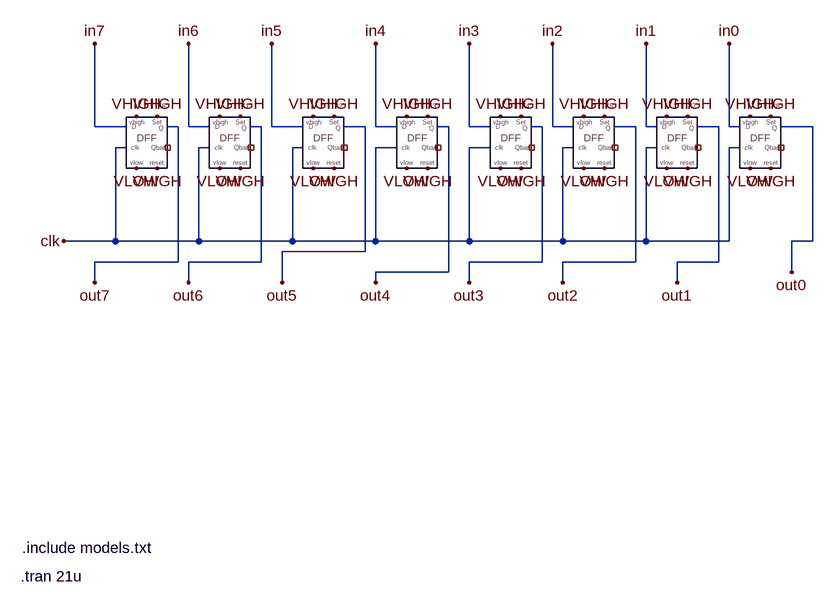
[diagram p0: schematic outputdoor.asc]
outputdoor.asc, the LTspice schematic file:
Version 4
SHEET 1 908 820
WIRE -208 112 -208 -16
WIRE -160 112 -208 112
WIRE -80 112 -96 112
WIRE -64 112 -64 -16
WIRE -32 112 -64 112
WIRE 48 112 32 112
WIRE 64 112 64 -16
WIRE 112 112 64 112
WIRE 208 112 176 112
WIRE 224 112 224 -16
WIRE 256 112 224 112
WIRE 336 112 320 112
WIRE 368 112 368 -16
WIRE 400 112 368 112
WIRE 480 112 464 112
WIRE 496 112 496 -16
WIRE 528 112 496 112
WIRE 624 112 592 112
WIRE 640 112 640 -16
WIRE 656 112 640 112
WIRE 752 112 720 112
WIRE 768 112 768 -16
WIRE 784 112 768 112
WIRE 896 112 848 112
WIRE -160 144 -176 144
WIRE -32 144 -48 144
WIRE 112 144 96 144
WIRE 256 144 224 144
WIRE 400 144 368 144
WIRE 528 144 512 144
WIRE 656 144 640 144
WIRE 784 144 768 144
WIRE -176 288 -176 144
WIRE -176 288 -256 288
WIRE -48 288 -48 144
WIRE -48 288 -176 288
WIRE 96 288 96 144
WIRE 96 288 -48 288
WIRE 224 288 224 144
WIRE 224 288 96 288
WIRE 368 288 368 144
WIRE 368 288 224 288
WIRE 512 288 512 144
WIRE 512 288 368 288
WIRE 640 288 640 144
WIRE 640 288 512 288
WIRE 768 288 768 144
WIRE 768 288 640 288
WIRE 896 288 896 112
WIRE 896 288 864 288
WIRE 208 304 208 112
WIRE 208 304 80 304
WIRE -80 320 -80 112
WIRE -80 320 -208 320
WIRE 48 320 48 112
WIRE 48 320 -64 320
WIRE 480 320 480 112
WIRE 480 320 368 320
WIRE 624 320 624 112
WIRE 624 320 512 320
WIRE 752 320 752 112
WIRE 752 320 688 320
WIRE 336 336 336 112
WIRE 336 336 224 336
WIRE 864 336 864 288
WIRE -208 352 -208 320
WIRE -64 352 -64 320
WIRE 80 352 80 304
WIRE 224 352 224 336
WIRE 368 352 368 320
WIRE 512 352 512 320
WIRE 688 352 688 320
FLAG -144 96 VHIGH
FLAG -112 96 VHIGH
FLAG -112 176 VHIGH
FLAG -16 96 VHIGH
FLAG 16 96 VHIGH
FLAG 16 176 VHIGH
FLAG 128 96 VHIGH
FLAG 160 96 VHIGH
FLAG 160 176 VHIGH
FLAG 304 176 VHIGH
FLAG 304 96 VHIGH
FLAG 272 96 VHIGH
FLAG 416 96 VHIGH
FLAG 448 96 VHIGH
FLAG 448 176 VHIGH
FLAG 576 96 VHIGH
FLAG 544 96 VHIGH
FLAG 576 176 VHIGH
FLAG 704 176 VHIGH
FLAG 704 96 VHIGH
FLAG 672 96 VHIGH
FLAG 672 176 VLOW
FLAG 544 176 VLOW
FLAG 416 176 VLOW
FLAG 272 176 VLOW
FLAG 128 176 VLOW
FLAG -16 176 VLOW
FLAG -144 176 VLOW
FLAG -256 288 clk
FLAG 640 -16 in1
FLAG 496 -16 in2
FLAG 368 -16 in3
FLAG 224 -16 in4
FLAG 64 -16 in5
FLAG -64 -16 in6
FLAG -208 -16 in7
FLAG 832 176 VHIGH
FLAG 832 96 VHIGH
FLAG 800 96 VHIGH
FLAG 800 176 VLOW
FLAG 768 -16 in0
FLAG 864 336 out0
FLAG 688 352 out1
FLAG 512 352 out2
FLAG 368 352 out3
FLAG 224 352 out4
FLAG 80 352 out5
FLAG -64 352 out6
FLAG -208 352 out7
SYMBOL DFF 48 128 R0
SYMATTR InstName X1
SYMBOL DFF 192 128 R0
SYMATTR InstName X2
SYMBOL DFF 336 128 R0
SYMATTR InstName X3
SYMBOL DFF 480 128 R0
SYMATTR InstName X4
SYMBOL DFF 608 128 R0
SYMATTR InstName X5
SYMBOL DFF -80 128 R0
SYMATTR InstName X6
SYMBOL DFF 736 128 R0
SYMATTR InstName X7
SYMBOL DFF 864 128 R0
SYMATTR InstName X8
TEXT -322 804 Left 2 !.tran 21u
TEXT -320 760 Left 2 !.include models.txt

The netlist it stands for:
* outputdoor.asc
XX1 in6 clk VHIGH VLOW VHIGH VHIGH out6 NC_01 DFF  ; pins D clk VHIGH VLOW set_b reset_b Q Qbar
XX2 in5 clk VHIGH VLOW VHIGH VHIGH out5 NC_02 DFF  ; pins D clk VHIGH VLOW set_b reset_b Q Qbar
XX3 in4 clk VHIGH VLOW VHIGH VHIGH out4 NC_03 DFF  ; pins D clk VHIGH VLOW set_b reset_b Q Qbar
XX4 in3 clk VHIGH VLOW VHIGH VHIGH out3 NC_04 DFF  ; pins D clk VHIGH VLOW set_b reset_b Q Qbar
XX5 in2 clk VHIGH VLOW VHIGH VHIGH out2 NC_05 DFF  ; pins D clk VHIGH VLOW set_b reset_b Q Qbar
XX6 in7 clk VHIGH VLOW VHIGH VHIGH out7 NC_06 DFF  ; pins D clk VHIGH VLOW set_b reset_b Q Qbar
XX7 in1 clk VHIGH VLOW VHIGH VHIGH out1 NC_07 DFF  ; pins D clk VHIGH VLOW set_b reset_b Q Qbar
XX8 in0 clk VHIGH VLOW VHIGH VHIGH out0 NC_08 DFF  ; pins D clk VHIGH VLOW set_b reset_b Q Qbar
.tran 21u
.include models.txt
.backanno
.end